# Altium schematic sheet flbmain.SchDoc
size A4; DocumentNumber: 2; SheetNumber: 2; SheetTotal: 6
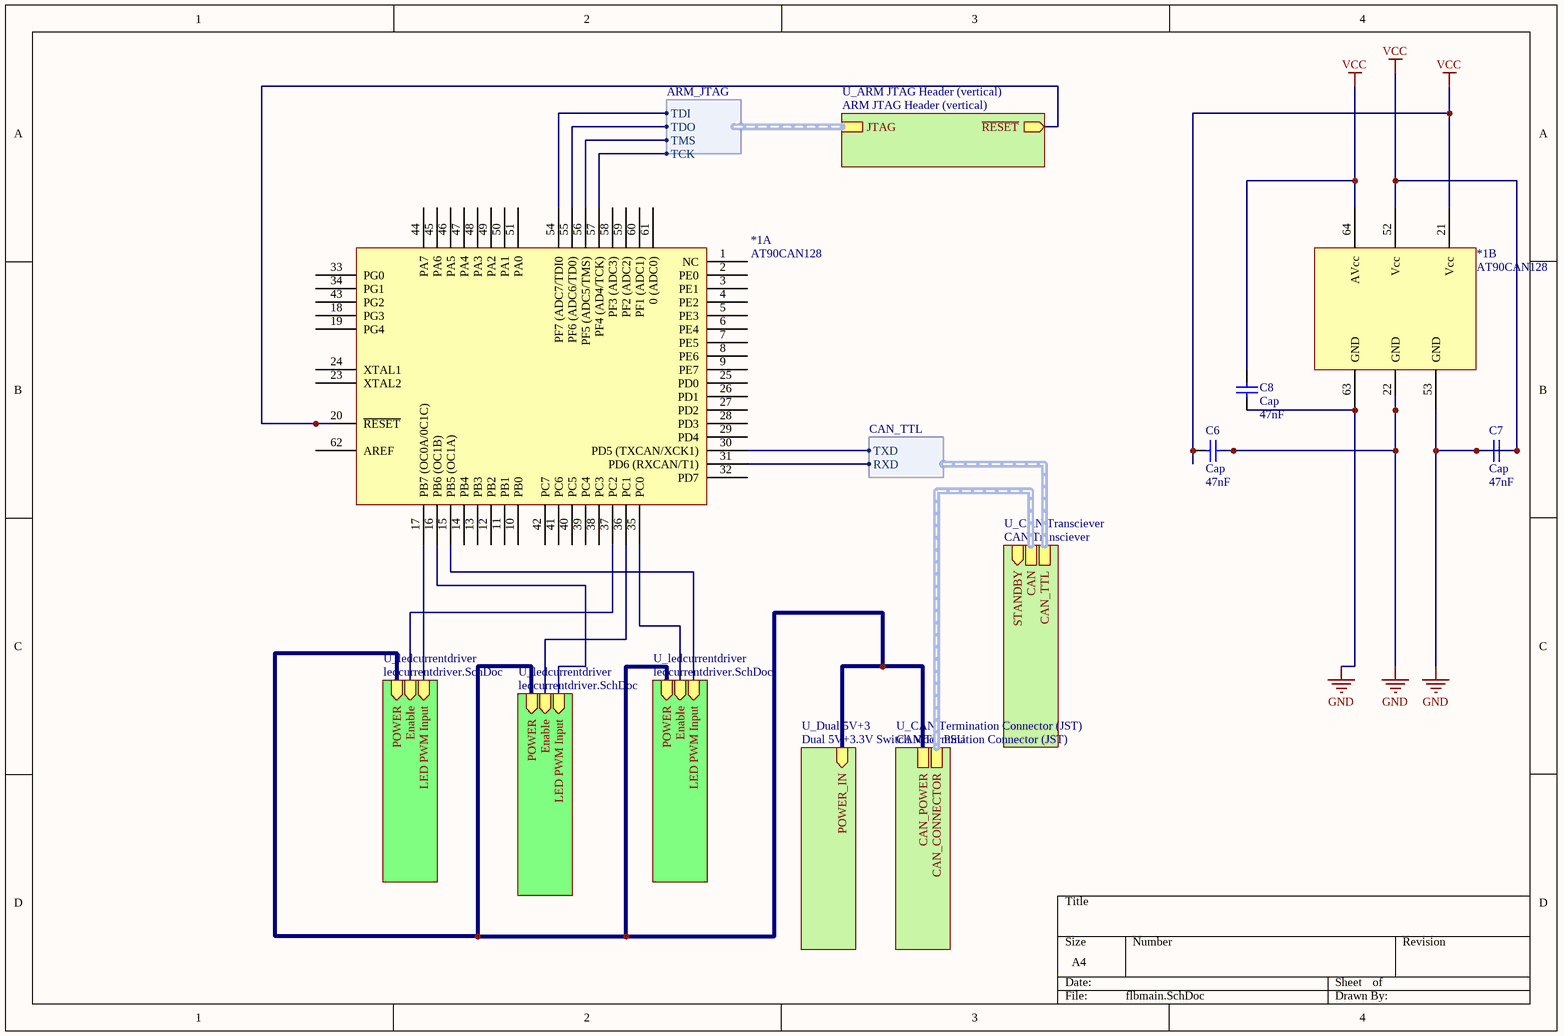
[diagram p0: flbmain.SchDoc]

## Parts
*1  AT90CAN128  [TQFP80P1600X1600X120-64N]  (parts A,B of 2)
C6  Cap  value 47nF  [RAD-0.3]
C7  Cap  value 47nF  [RAD-0.3]
C8  Cap  value 47nF  [RAD-0.3]

## Sub-sheets
U_ARM JTAG Header (vertical) = ARM JTAG Header (vertical): JTAG (harness ARM_JTAG), ~{RESET} (out)
U_CAN Termination Connector (JST) = CAN Termination Connector (JST): CAN_CONNECTOR (harness CAN), CAN_POWER
U_CAN Transciever = CAN Transciever: CAN_TTL (harness CAN_TTL), CAN (harness CAN), STANDBY (in)
U_Dual 5V+3 = Dual 5V+3.3V Switch Mode PSU: POWER_IN (in)
U_ledcurrentdriver = ledcurrentdriver.SchDoc: LED PWM Input (in), Enable (in), POWER (in)
U_ledcurrentdriver = ledcurrentdriver.SchDoc: LED PWM Input (in), Enable (in), POWER (in)
U_ledcurrentdriver = ledcurrentdriver.SchDoc: LED PWM Input (in), Enable (in), POWER (in)

## Harnesses
CAN_TTL: TXD, RXD
ARM_JTAG: TDI, TDO, TMS, TCK

## Nets
GND: *1.21(Vcc) *1.22(GND) *1.52(Vcc) *1.53(GND) *1.63(GND) *1.64(AVcc) C6.1 C6.2 C7.1 C7.2 C8.1 C8.2  [also labelled VCC]
Net*1_15: *1.15(PB5_(OC1A)) ; sheet U_ledcurrentdriver/LED PWM Input
Net*1_16: *1.16(PB6_(OC1B)) ; sheet U_ledcurrentdriver/LED PWM Input
Net*1_17: *1.17(PB7_(OC0A/0C1C)) ; sheet U_ledcurrentdriver/LED PWM Input
Net*1_20: *1.20(~{RESET}) ; sheet U_ARM JTAG Header (vertical)/~{RESET}
Net*1_30: *1.30(PD5_(TXCAN/XCK1)) ; sheet U_CAN Transciever/CAN_TTL.TXD
Net*1_31: *1.31(PD6_(RXCAN/T1)) ; sheet U_CAN Transciever/CAN_TTL.RXD
Net*1_35: *1.35(PC0) ; sheet U_ledcurrentdriver/Enable
Net*1_36: *1.36(PC1) ; sheet U_ledcurrentdriver/Enable
Net*1_37: *1.37(PC2) ; sheet U_ledcurrentdriver/Enable
Net*1_54: *1.54(PF7_(ADC7/TDI0) ; sheet U_ARM JTAG Header (vertical)/JTAG.TDI
Net*1_55: *1.55(PF6_(ADC6/TD0)) ; sheet U_ARM JTAG Header (vertical)/JTAG.TDO
Net*1_56: *1.56(PF5_(ADC5/TMS)) ; sheet U_ARM JTAG Header (vertical)/JTAG.TMS
Net*1_57: *1.57(PF4_(AD4/TCK)) ; sheet U_ARM JTAG Header (vertical)/JTAG.TCK
(unnamed): sheet U_CAN Termination Connector (JST)/CAN_POWER, sheet U_Dual 5V+3/POWER_IN, sheet U_ledcurrentdriver/POWER, sheet U_ledcurrentdriver/POWER, sheet U_ledcurrentdriver/POWER

Not connected (* = marked no-connect by the designer): *1 1(NC) 2(PE0) 3(PE1) 4(PE2) 5(PE3) 6(PE4) 7(PE5) 8(PE6) 9(PE7) 10(PB0) 11(PB1) 12(PB2) 13(PB3) 14(PB4) 18(PG3) 19(PG4) 23(XTAL2) 24(XTAL1) 25(PD0) 26(PD1) 27(PD2) 28(PD3) 29(PD4) 32(PD7) 33(PG0) 34(PG1) 38(PC3) 39(PC4) 40(PC5) 41(PC6) 42(PC7) 43(PG2) 44(PA7) 45(PA6) 46(PA5) 47(PA4) 48(PA3) 49(PA2) 50(PA1) 51(PA0) 58(PF3_(ADC3)) 59(PF2_(ADC2)) 60(PF1_(ADC1)) 61(0_(ADC0)) 62(AREF)

## Buses and harness runs
harness sheet U_CAN Termination Connector (JST)/CAN_CONNECTOR = sheet U_CAN Transciever/CAN

## Library data of the parts
C6-C8 = Cap: Capacitor; Published: 8-Jun-2000; LatestRevisionDate: 17-Jul-2002; LatestRevisionNote: Re-released for DXP Platform.; PackageReference: RAD-0.3; Publisher: Altium Limited; PackageDescription: Radial Cap, Thru-Hole; 2 Leads; 0.3 in Pin Spacing